# Altium schematic sheet Power_Supply.SchDoc
size A4; SheetNumber: 3; SheetTotal: 3
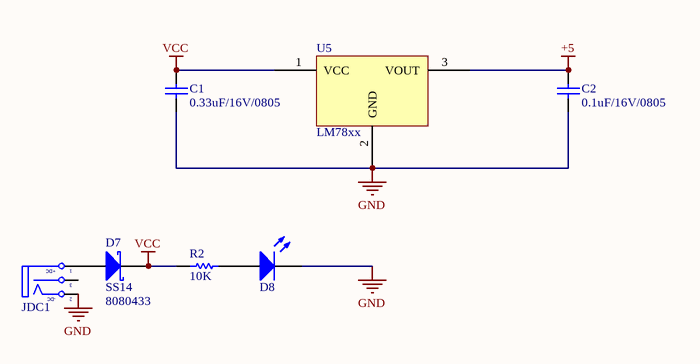
[diagram p0: Power_Supply.SchDoc]

## Parts
C1  value 0.33uF/16V/0805  [CAP-SM-0805]  (hidden comment: Cap Non-Pol SMD)
C2  value 0.1uF/16V/0805  [CAP-SM-0805]  (hidden comment: Cap Non-Pol SMD)
D7  Supplier Part Number 1: SS14  Supplier Part Number 2: 8080433  [SS34]  (hidden comment: D Schottky)
D8  LED SMD  [LED_0805_Blue]  (value not drawn)
JDC1  Jack DC  [DC-IN]  (value not drawn)
R2  value 10K  [RES-SM-0805]  (hidden comment: RESISTOR SMD)
U5  LM78xx  [DPAK228P1014X239-3N]

## Nets
+5: C2.2 U5.3(VOUT)
GND: C1.1 C2.1 D8.2(K) JDC1.2(TN) U5.2(GND)
VCC: C1.2 D7.K R2.1 U5.1(VCC)
NetD7_A: D7.A JDC1.1(T)
NetD8_1: D8.1(A) R2.2

Not connected (* = marked no-connect by the designer): JDC1 3(S)

## Notes on the sheet
- (in symbol Jack DC) +DC; -DC

## Library data of the parts
C1 C2 = Cap Non-Pol SMD: Capacitor
D7 = D Schottky: Schottky Diode; Published: 8-Jun-2000; LatestRevisionDate: 17-Jul-2002; LatestRevisionNote: Re-released for DXP Platform.; PackageReference: SMB; Publisher: Altium Limited; PackageDescription: DO-214-AA/SMB; 2 C-Bend Leads; Body 5.3 x 3.6 mm, inc. leads (LxW); Code_JEDEC: DO-214-AA; Supplier 1: Arrow Electronics; Supplier 2: RSComponents
D8 = LED SMD: LED
JDC1 = Jack DC: Jack DC input; Value: Jac DC
R2 = RESISTOR SMD: Resistor